# EAGLE design Z2T (EAGLE 9.6.2)
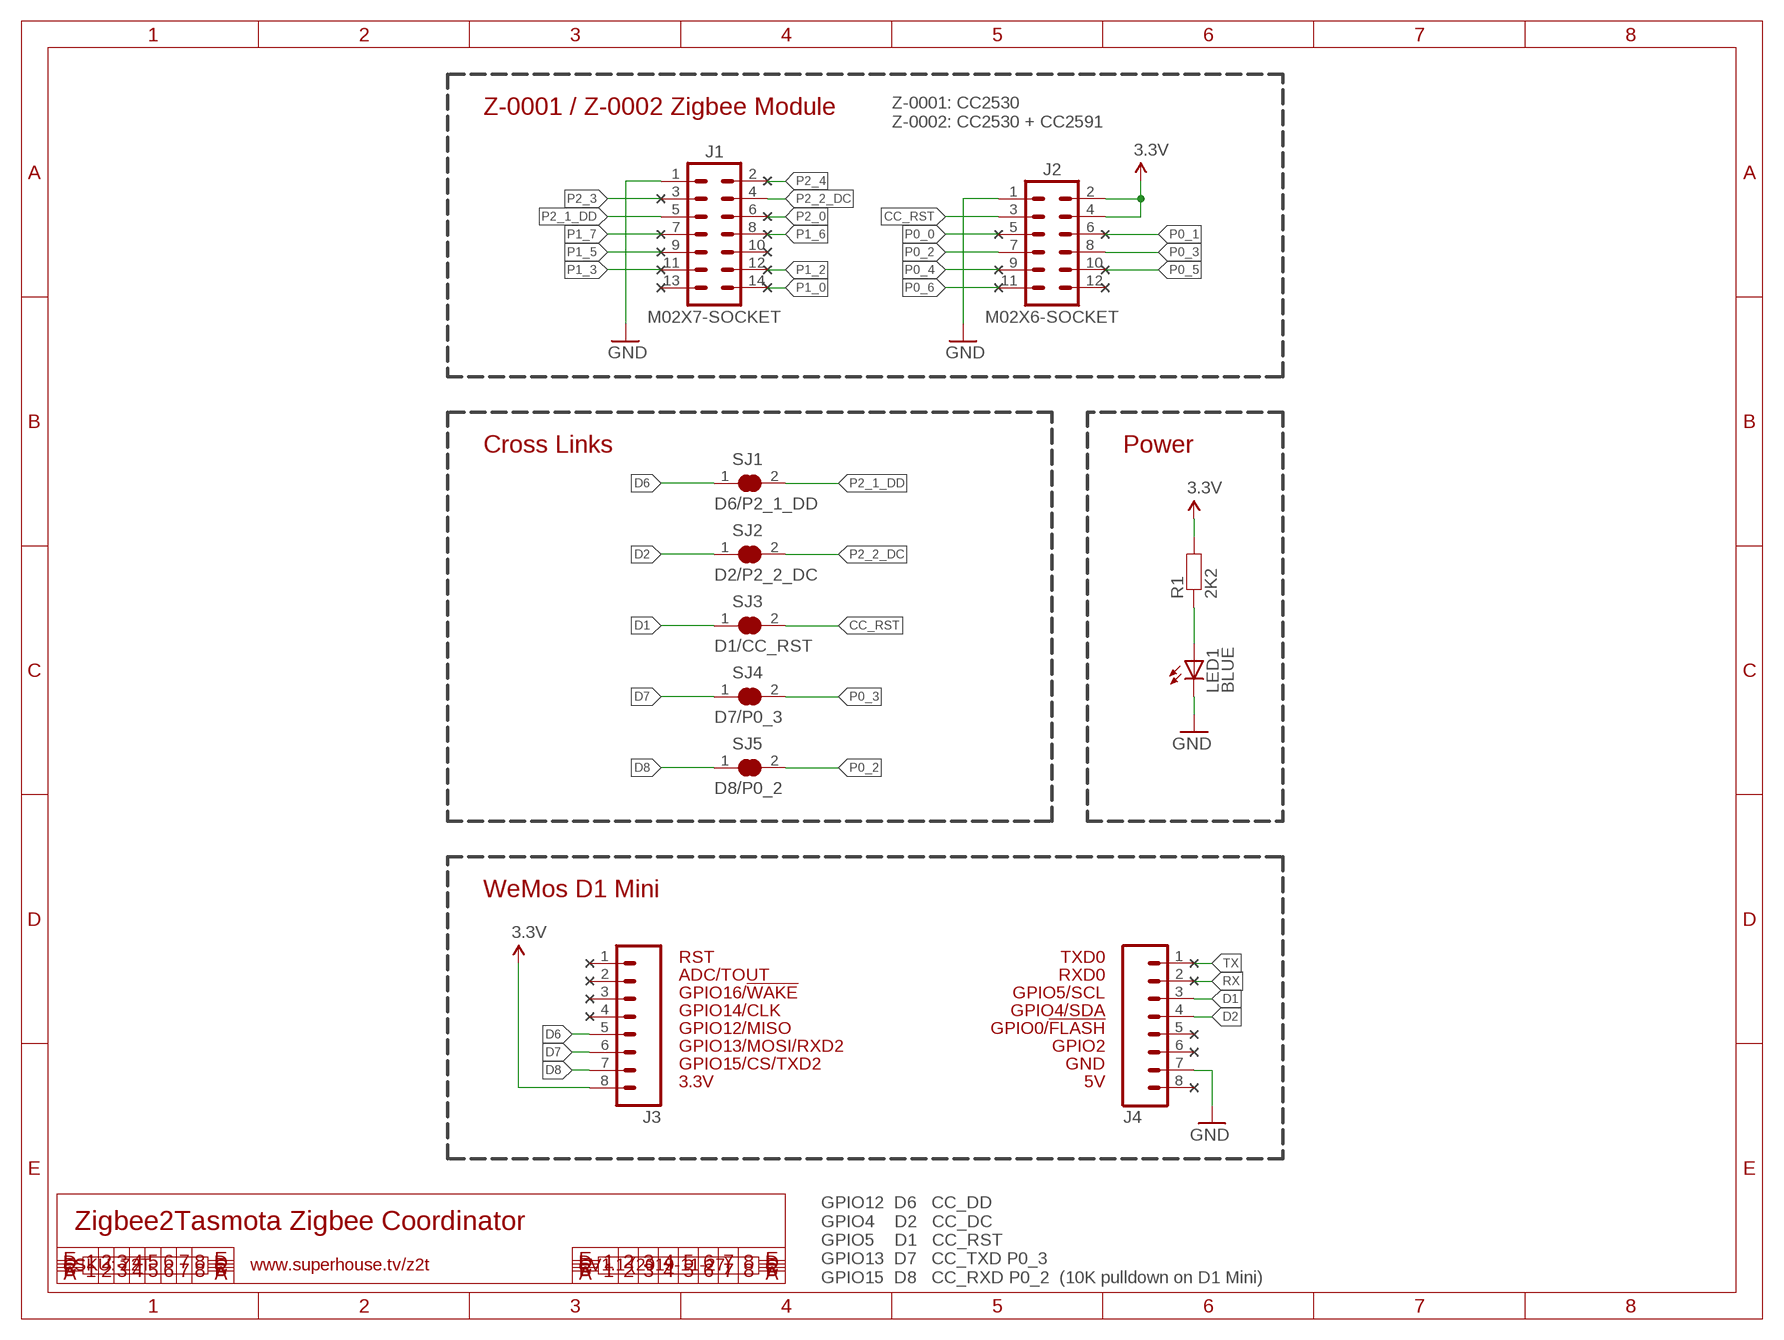
[diagram p0: schematic, sheet 1]

## Parts
J1  M02X7-SOCKET  [2X07-S]
J2  M02X6-SOCKET  [2X06-S]
J3  M08  [1X08]
J4  M08  [1X08]
LED1  BLUE  LED0603  [LED-0603]
R1  2K2  RESISTOR0603  [R0603]
SJ1  D6/P2_1_DD  SJC-NORMAL  [SJC]
SJ2  D2/P2_2_DC  SJC-NORMAL  [SJC]
SJ3  D1/CC_RST  SJC-NORMAL  [SJC]
SJ4  D7/P0_3  SJC-NORMAL  [SJC]
SJ5  D8/P0_2  SJC-NORMAL  [SJC]

## Nets
3.3V: J2.2 J2.4 J3.8 R1.2
CC_RST: J2.3 SJ3.2
D1: J4.3 SJ3.1
D2: J4.4 SJ2.1
D6: J3.5 SJ1.1
D7: J3.6 SJ4.1
D8: J3.7 SJ5.1
GND: J1.1 J2.1 J4.7 LED1.C
N$1: LED1.A R1.1
P0_0: J2.5
P0_1: J2.6
P0_2: J2.7 SJ5.2
P0_3: J2.8 SJ4.2
P0_4: J2.9
P0_5: J2.10
P0_6: J2.11
P1_0: J1.14
P1_2: J1.12
P1_3: J1.11
P1_5: J1.9
P1_6: J1.8
P1_7: J1.7
P2_0: J1.6
P2_1_DD: J1.5 SJ1.2
P2_2_DC: J1.4 SJ2.2
P2_3: J1.3
P2_4: J1.2
RX: J4.2
TX: J4.1
Unconnected: J1.10 J1.13 J2.12 J3.1 J3.2 J3.3 J3.4 J4.5 J4.6 J4.8

## Notes on the sheet
- Z-0001 / Z-0002 Zigbee Module
- Z-0001: CC2530
  Z-0002: CC2530 + CC2591
- Cross Links | Power
- WeMos D1 Mini
- RST | TXD0
- ADC/TOUT | RXD0
- GPIO16/!WAKE | GPIO5/SCL
- GPIO14/CLK | GPIO4/SDA
- GPIO12/MISO | GPIO0/!FLASH
- GPIO13/MOSI/RXD2 | GPIO2
- GPIO15/CS/TXD2 | GND
- 3.3V | 5V
- Zigbee2Tasmota Zigbee Coordinator
- SKU: Z2T | www.superhouse.tv/z2t | V1.1 (2019-11-27)
- GPIO12  D6   CC_DD
  GPIO4    D2   CC_DC
  GPIO5    D1   CC_RST
  GPIO13  D7   CC_TXD P0_3
  GPIO15  D8   CC_RXD P0_2  (10K pulldown on D1 Mini)

## Library data of the parts
J1 = SuperHouse-Connectors:M02X7: M14 header in 2x7 format
J2 = SuperHouse-Connectors:M02X6: M12 header in 2x6 format
J3 J4 = freetronics-original:M08: Header 8 Standard 8-pin 0.1" header. Use with straight break away headers (SKU : PRT-00116), right angle break away headers (PRT-00553), swiss pins (PRT-00743), machine pins (PRT-00117), and female headers (PRT-00115).
LED1 = SuperHouse-LEDs:LED: LEDs Standard schematic elements and footprints for 5mm, 3mm, 1206, and 0603 sized LEDs. 5mm - Spark Fun Electronics SKU : COM-00529 (and others)
R1 = SuperHouse-DiscreteSemi:RESISTOR: Resistor Standard resistors.
SJ1-SJ5 = SuperHouse-Jumpers:SJC: Solder jumper. Normally closed: does not need solder to close. Can be opened by cutting the track.

## Net classes
0 default: width 0.203 mm, drill 0.356 mm, clearance 0.152 mm
1 power: width 0.203 mm, clearance 0.152 mm

## Board
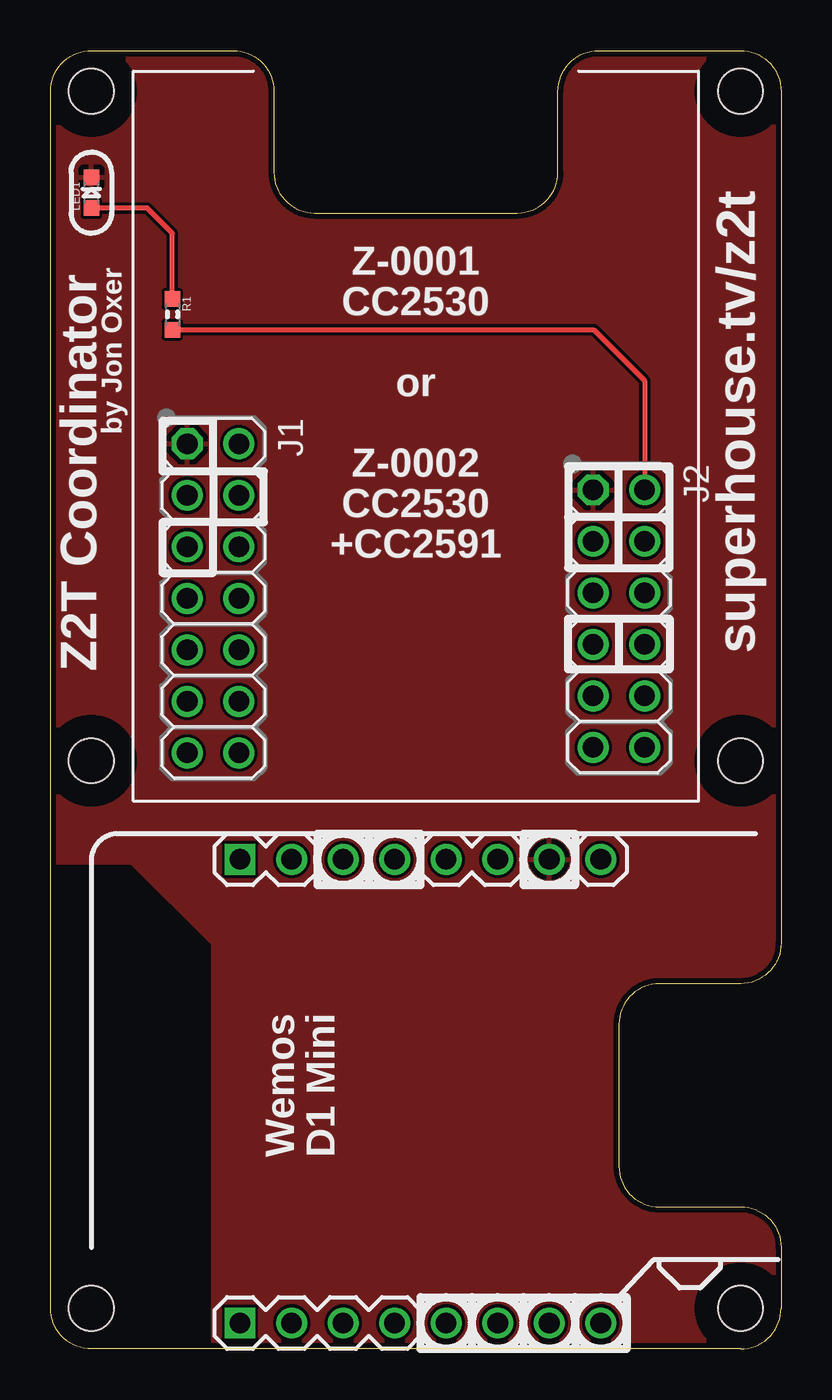
[diagram p1: board, top side]
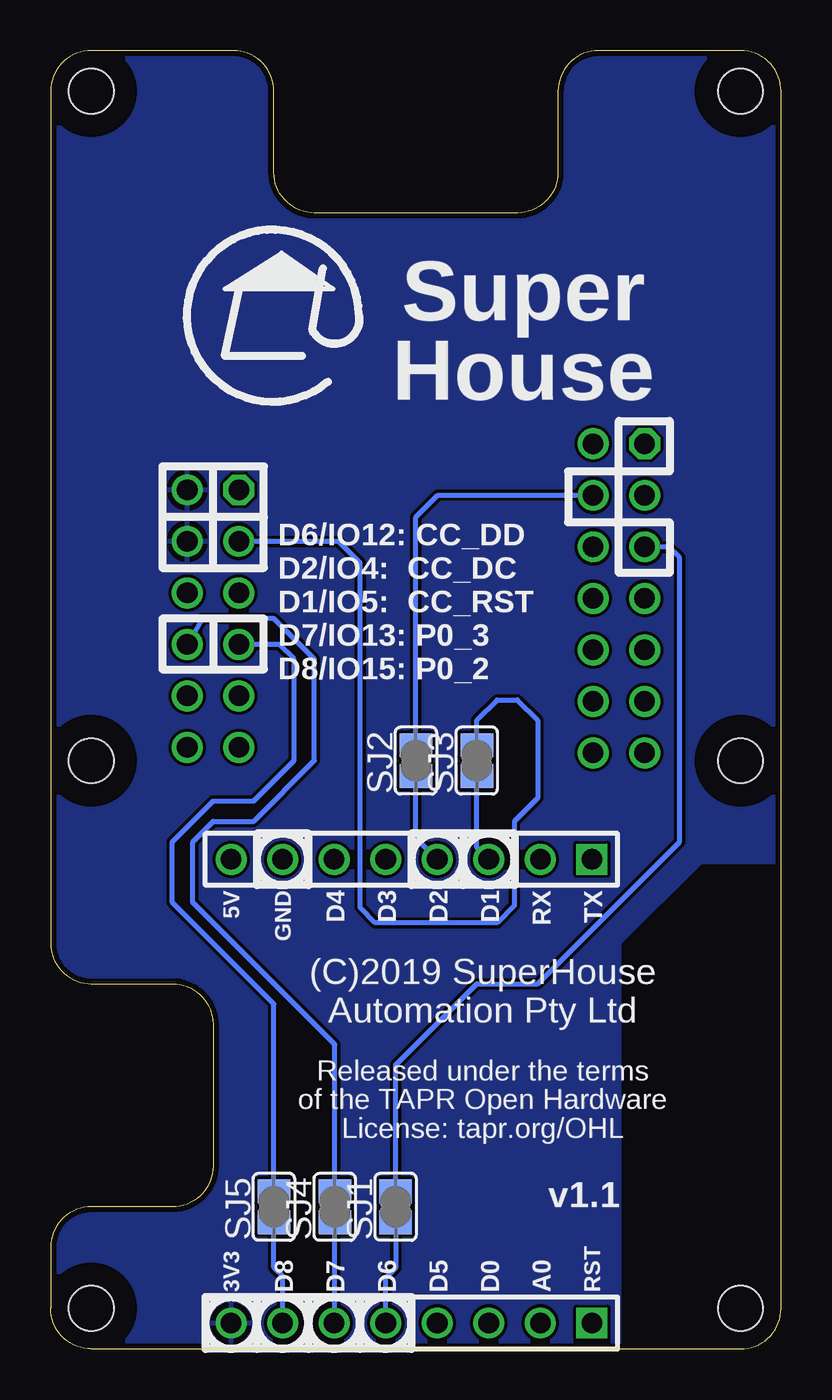
[diagram p2: board, bottom side, seen from below]

Size 36 x 64 mm. Coordinates in mm from the lower left corner, seen from the top.
Outline: 2,64 9,64 arc-90 11,62 11,58 arc90 13,56 23,56 arc90 25,58 25,62 arc-90 27,64 34,64 arc-90 36,62 36,20 arc-90 34,18 30,18 arc90 28,16 28,9 arc90 30,7 34,7 arc-90 36,5 36,2 arc-90 34,0 2,0 arc-90 0,2 0,62 arc-90 2,64
Copper layers (1*16): Top 0.035mm / dielectric 1.5mm / Bottom 0.035mm
Design rules "dirt_cheap_dirty_boards.v1": minimum track width 5mil, minimum drill 12mil, track to track 5mil, track to pad 5mil, pad to pad 5mil, via to via 5mil, smd to smd 0mil, copper to edge 10mil, drill to drill 10mil, minimum pad ring 10mil, minimum via ring 6mil, stop-mask expansion 2mil, vias tented up to drill 25mil, thermal gap 10mil
Holes 2.2 mm at 2,62 34,62 2,2 34,2 2,29 34,29
tRestrict: area -0.2,59.8 to 4.2,64.2; area 31.8,59.8 to 36.2,64.2; area 31.8,26.8 to 36.2,31.2; area -0.2,26.8 to 4.2,31.2; area 31.8,-0.2 to 36.2,4.2; area -0.2,-0.2 to 4.2,4.2
bRestrict: area 31.8,-0.2 to 36.2,4.2; area -0.2,59.8 to 4.2,64.2; area 31.8,59.8 to 36.2,64.2; area -0.2,26.8 to 4.2,31.2; area 31.8,26.8 to 36.2,31.2; area -0.2,-0.2 to 4.2,4.2

### Footprints (pad centres in the part's own frame; a part is rotated, then mirrored left to right if it is on the bottom)
2X07-S = drill 1.016 octagon: 1 -7.62,-1.27 | drill 1.016: 2 -7.62,1.27; 3 -5.08,-1.27; 4 -5.08,1.27; 5 -2.54,-1.27; 6 -2.54,1.27; 7 0,-1.27; 8 0,1.27; 9 2.54,-1.27; 10 2.54,1.27; 11 5.08,-1.27; 12 5.08,1.27; 13 7.62,-1.27; 14 7.62,1.27
2X06-S = drill 1.016 octagon: 1 -6.35,-1.27 | drill 1.016: 2 -6.35,1.27; 3 -3.81,-1.27; 4 -3.81,1.27; 5 -1.27,-1.27; 6 -1.27,1.27; 7 1.27,-1.27; 8 1.27,1.27; 9 3.81,-1.27; 10 3.81,1.27; 11 6.35,-1.27; 12 6.35,1.27
1X08 = drill 1.016 square: 1 0,0 | drill 1.016: 2 2.54,0; 3 5.08,0; 4 7.62,0; 5 10.16,0; 6 12.7,0; 7 15.24,0; 8 17.78,0
LED-0603 = smd 0.762 x 0.762: A -0.762,0; C 0.762,0
R0603 = smd 0.762 x 0.762: 1 -0.762,0; 2 0.762,0
SJC = smd 1.168 x 1.6: 1 -0.762,0; 2 0.762,0

### Placement (x,y rotation side)
J1  8,37 270 top
J2  28,36 270 top
J3  9.33,1.27 0 top
J4  9.33,24.13 0 top
LED1  2,57 90 top
R1  6,51 270 top
SJ1  19,7 90 bottom
SJ2  18,29 90 bottom
SJ3  15,29 90 bottom
SJ4  22,7 90 bottom
SJ5  25,7 90 bottom

### Tracks (layer width: path | path; a pad name or v marks a point on that pad's centre or on a via)
3.3V
  Top 0.254: R1.2 26.76,50.24 29.27,47.73 J2.2
  pour Bottom: 34,64 27,64 arc90 25,62 25,58 arc-90 23,56 13,56 arc-90 11,58 11,62 arc90 9,64 2,64 arc90 0,62 0,24 4,24 8,20 8,0 34,0 arc90 36,2 36,5 arc90 34,7 30,7 arc-90 28,9 28,16 arc-90 30,18 34,18 arc90 36,20 36,62 arc90
CC_RST
  Bottom 0.254: SJ3.2 15,31 14,32 13,32 12,31 12,27.15 13.15,26 13.15,21.85 14,21 20,21 20.75,21.75 20.75,38.75 21.81,39.81 J2.3
D1
  Bottom 0.254: J4.3 15,24.72 SJ3.1
D2
  Bottom 0.254: J4.4 18,25.18 SJ2.1
D6
  Bottom 0.254: J3.5 19.49,3.51 19,4 SJ1.1
D7
  Bottom 0.254: J3.6 22,1.3 SJ4.1
D8
  Bottom 0.254: J3.7 24.57,3.57 25,4 SJ5.1
GND
  pour Top: 2,64 arc90 0,62 0,24 4,24 8,20 8,0 34,0 arc90 36,2 36,5 arc90 34,7 30,7 arc-90 28,9 28,16 arc-90 30,18 34,18 arc90 36,20 36,62 arc90 34,64 27,64 arc90 25,62 25,58 arc-90 23,56 13,56 arc-90 11,58 11,62 arc90 9,64
N$1
  Top 0.254: R1.1 6,55 4.76,56.24 LED1.A
P0_2
  Bottom 0.254: SJ5.2 25,17 30,22 30,25 28,27 26,27 24,29 24,34 24.73,34.73 J2.7
P0_3
  Bottom 0.254: SJ4.2 22,15 29,22 29,25 28,26 26,26 23,29 23,34 25,36 28.5,36 J2.8
P2_1_DD
  Bottom 0.254: SJ1.2 19,14 15,18 12,18 5,25 5,39 5.54,39.54 J1.5
P2_2_DC
  Bottom 0.254: SJ2.2 18,41 16.92,42.08 J1.4

### Text on the board
tPlace: by Jon Oxer | superhouse.tv/z2t | Z2T Coordinator | Z-0001 / CC2530 / / or / / Z-0002 / CC2530 / +CC2591 | Wemos / D1 Mini
bPlace: Super / House | D6/IO12: CC_DD / D2/IO4: CC_DC / D1/IO5: CC_RST / D7/IO13: P0_3 / D8/IO15: P0_2 | TX | RX | D1 | D2 | D3 | D4 | GND | 5V | (C)2019 SuperHouse / Automation Pty Ltd | Released under the terms / of the TAPR Open Hardware / License: tapr.org/OHL | v1.1 | RST | A0 | D0 | D5 | D6 | D7 | D8 | 3V3